# EAGLE design PIC32 (EAGLE 8.1.0)
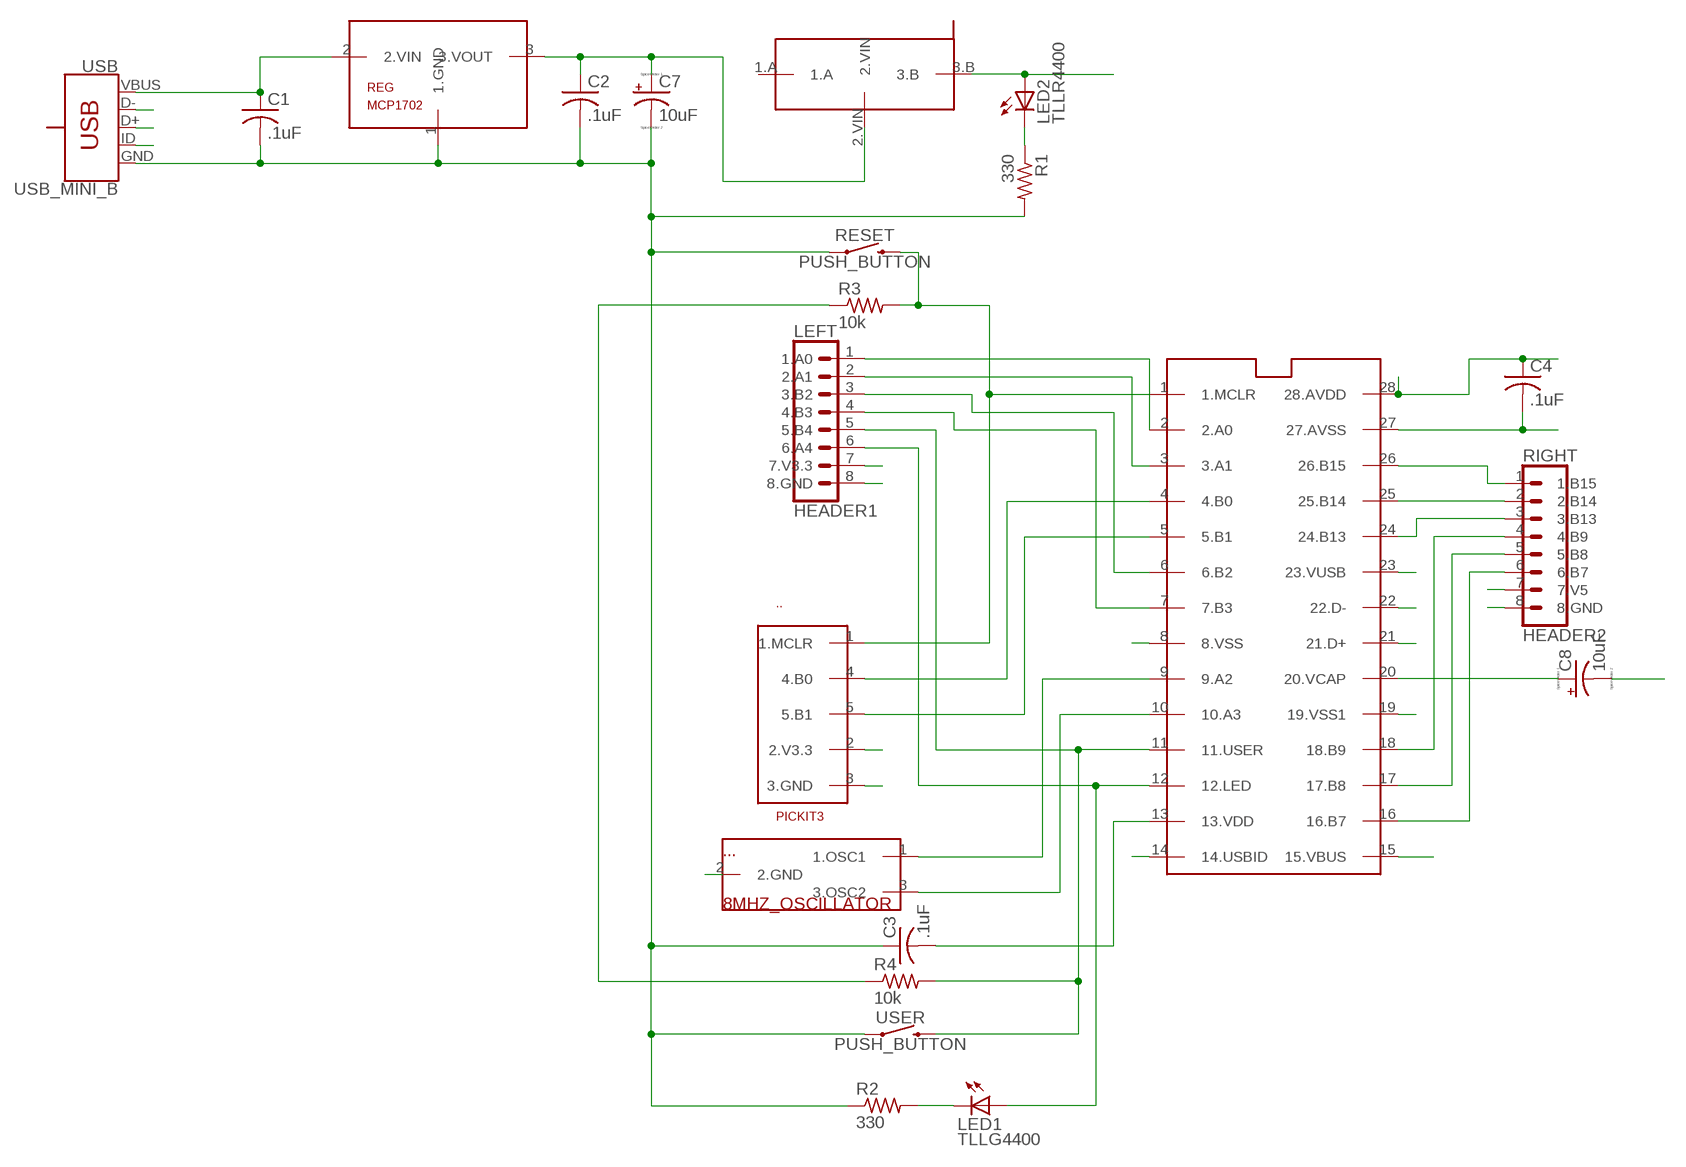
[diagram p0: schematic, sheet 1]

## Parts
..  PICKIT3  [1X05]
...  8MHZ_OSCILLATOR  [1X03]
C1  .1uF  C-US025-025X050  [C025-025X050]
C2  .1uF  C-US025-025X050  [C025-025X050]
C3  .1uF  C-US025-025X050  [C025-025X050]
C4  .1uF  C-US025-025X050  [C025-025X050]
C7  10uF  CPOL-USE5-8.5  [E5-8,5]
C8  10uF  CPOL-USE5-8.5  [E5-8,5]
DIP_28  PIC32MX250F128_DIP  [DIL28-3]
LED1  TLLG4400  [LED3MM]
LED2  TLLR4400  [LED3MM]
LEFT  HEADER1  [1X08]
R1  330  R-US_0207/10  [0207/10]
R2  330  R-US_0207/10  [0207/10]
R3  10k  R-US_0207/10  [0207/10]
R4  10k  R-US_0207/10  [0207/10]
REG  MCP1702  [TO92]
RESET  PUSH_BUTTON  [PB]
RIGHT  HEADER2  [1X08]
U$5  SLIDE_SWITCH  [SLIDE_SWITCH]
USB  USB_MINI_B  [USB-MB-H]
USER  PUSH_BUTTON  [PB]

## Nets
A0: DIP_28.2(2.A0) LEFT.1(1.A0)
A1: DIP_28.3(3.A1) LEFT.2(2.A1)
A2: ....1(1.OSC1) DIP_28.9(9.A2)
A3: ....3(3.OSC2) DIP_28.10(10.A3)
A4: DIP_28.12(12.LED) LED1.A LEFT.6(6.A4)
B0: ...4(4.B0) DIP_28.4(4.B0)
B1: ...5(5.B1) DIP_28.5(5.B1)
B2: DIP_28.6(6.B2) LEFT.3(3.B2)
B3: DIP_28.7(7.B3) LEFT.4(4.B3)
B4: DIP_28.11(11.USER) LEFT.5(5.B4) R4.2 USER.2
B7: DIP_28.16(16.B7) RIGHT.6(6.B7)
B8: DIP_28.17(17.B8) RIGHT.5(5.B8)
B9: DIP_28.18(18.B9) RIGHT.4(4.B9)
B13: DIP_28.24(24.B13) RIGHT.3(3.B13)
B14: DIP_28.25(25.B14) RIGHT.2(2.B14)
B15: DIP_28.26(26.B15) RIGHT.1(1.B15)
D+: DIP_28.21(21.D+) USB.D+(3.D+)
D-: DIP_28.22(22.D-) USB.D-(2.D-)
GND: ...3(3.GND) ....2(2.GND) C1.2 C2.2 C3.1 C4.2 C7.- C8.- DIP_28.8(8.VSS) DIP_28.27(27.AVSS) LEFT.8(8.GND) R1.2 R2.1 REG.1(1.GND) RESET.1 RIGHT.8(8.GND) USB.GND(5.GND) USER.1
ID: DIP_28.14(14.USBID) USB.ID(4.ID)
MCLR: ...1(1.MCLR) DIP_28.1(1.MCLR) R3.2 RESET.2
N$4: C2.1 C7.+ REG.3(3.VOUT) U$5.2.VIN
N$5: LED2.K(C) R1.1
N$14: LED1.K(C) R2.2
V3.3: ...2(2.V3.3) C3.2 C4.1 DIP_28.13(13.VDD) DIP_28.19(19.VSS1) DIP_28.23(23.VUSB) DIP_28.28(28.AVDD) LED2.A LEFT.7(7.V3.3) R3.1 R4.1 U$5.3.B
VBUS: C1.1 DIP_28.15(15.VBUS) REG.2(2.VIN) RIGHT.7(7.V5) USB.VBUS(1.VBUS)
VCAP: C8.+ DIP_28.20(20.VCAP)
Unconnected: U$5.1.A

## Library data of the parts
.. = meche-433:PICKIT3
... = meche-433:8MHZ_OSCILLATOR
C1-C4 = resistor:C-US: CAPACITOR, American symbol
C7 C8 = resistor:CPOL-US: POLARIZED CAPACITOR, American symbol
DIP_28 = meche-433:PIC32MX250F128_DIP
LED1 = led:TLLG4400: Low Current (2mA) LED 3 mm Tinted Diffused Package color GREEN Source: Data sheet <http://www.farnell.com/datasheets/391098.pdf>; MF: VISHAY SEMICONDUCTOR; OC_FARNELL: 1612435
LED2 = led:TLLR4400: Low Current (2mA) LED 3 mm Tinted Diffused Package color RED Source: Data sheet <http://www.farnell.com/datasheets/391100.pdf>; MF: VISHAY SEMICONDUCTOR; OC_FARNELL: 1612437
LEFT = meche-433:HEADER1
R1-R4 = resistor:R-US_: RESISTOR, American symbol
REG = meche-433:MCP1702
RESET USER = meche-433:PUSH_BUTTON
RIGHT = meche-433:HEADER2
U$5 = meche-433:SLIDE_SWITCH
USB = meche-433:USB_MINI_B

## Board
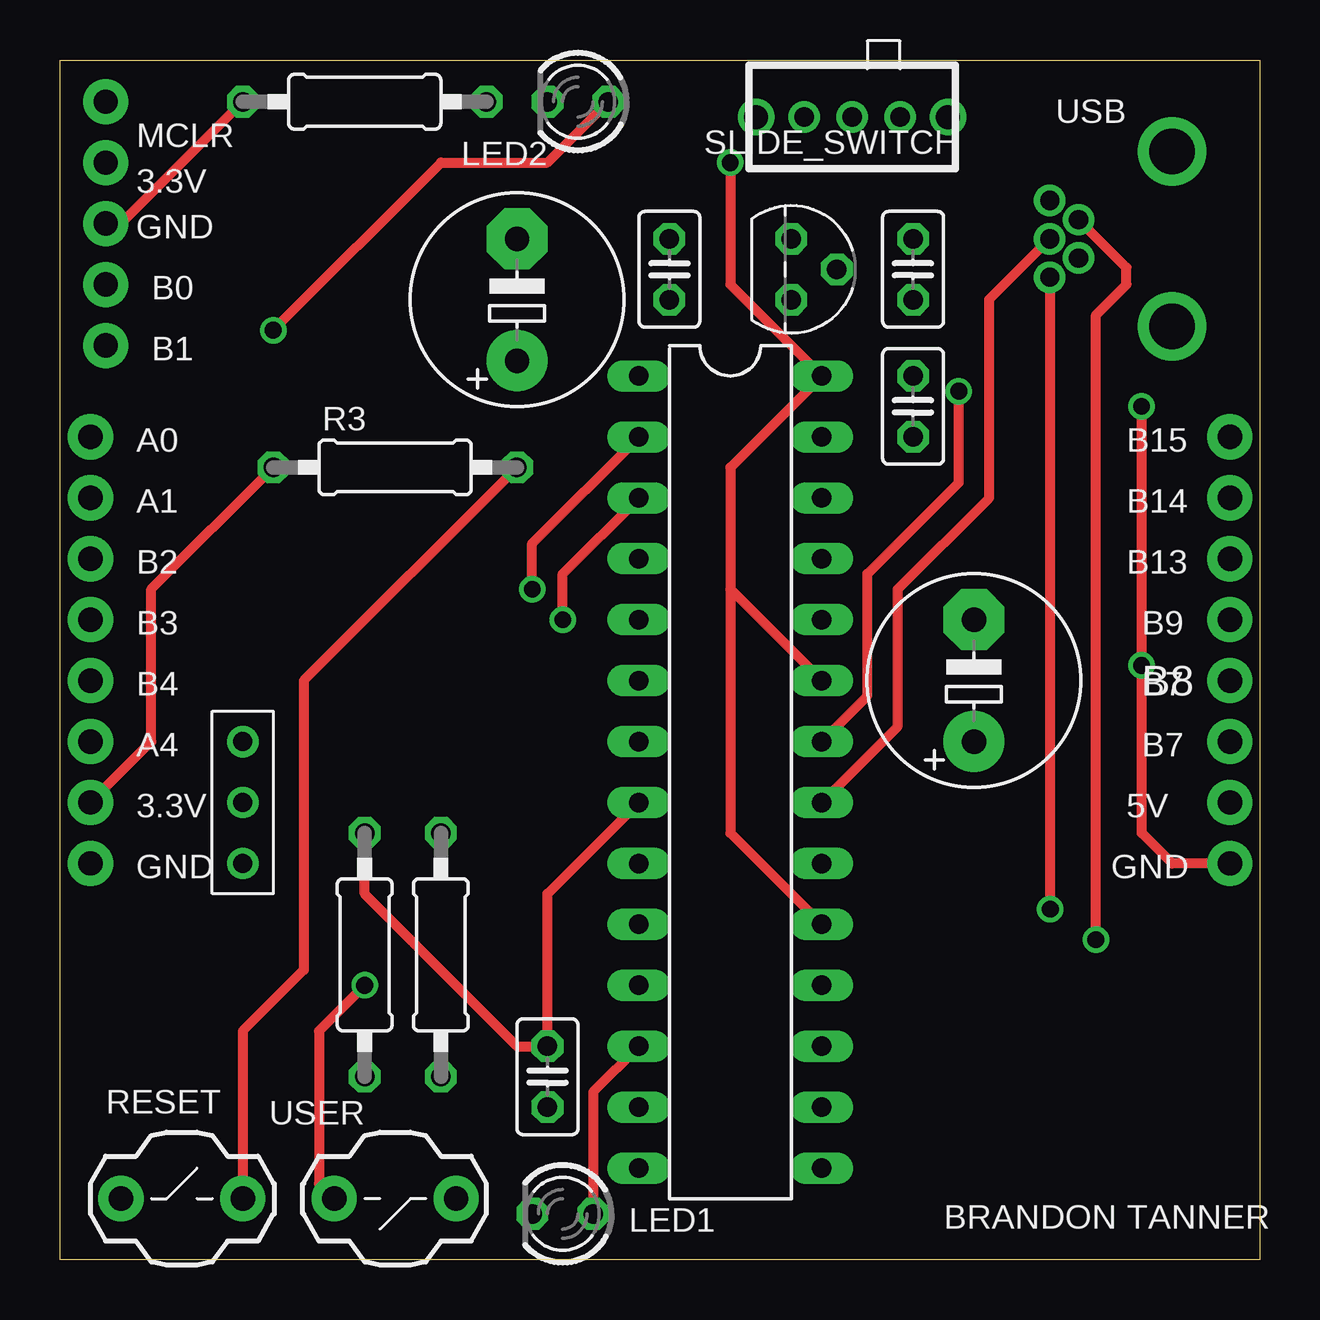
[diagram p1: board, top side]
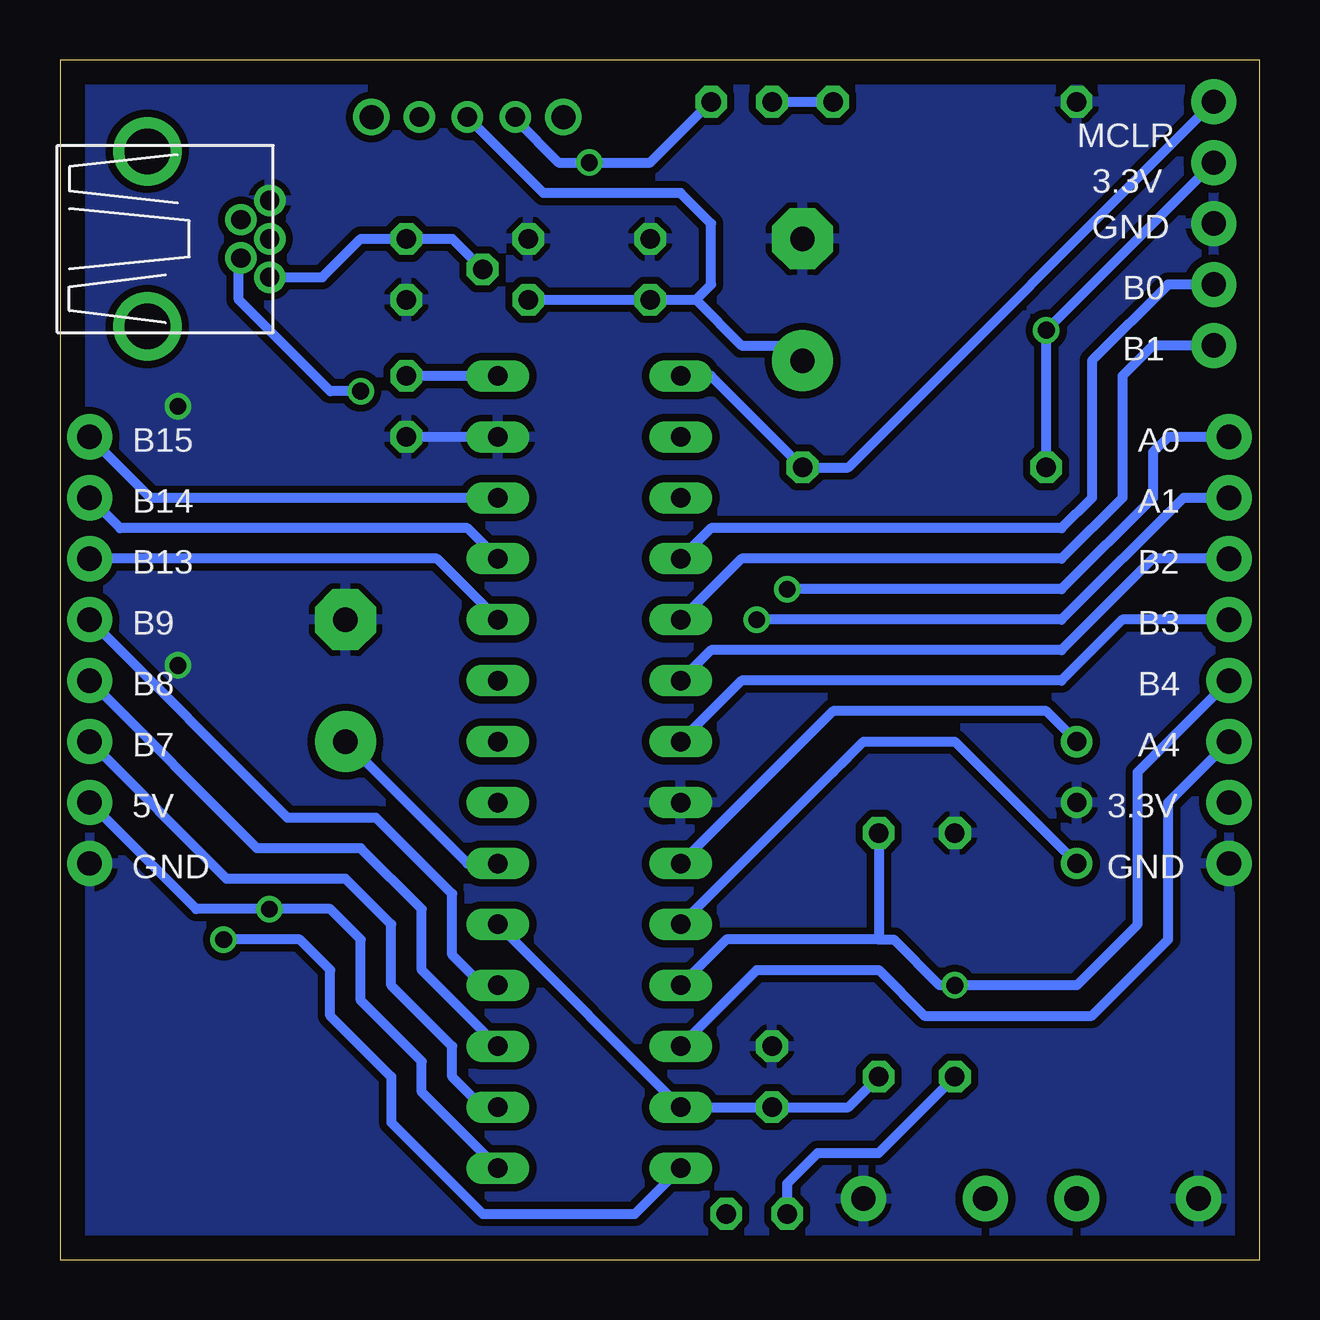
[diagram p2: board, bottom side, seen from below]

Size 50 x 50 mm. Coordinates in mm from the lower left corner, seen from the top.
Outline: 50,0 0,0 0,50 50,50 50,0
Copper layers (1*16): Top 0.035mm / dielectric 1.5mm / Bottom 0.035mm
Design rules "default": minimum track width 10mil, minimum drill 24mil, track to track 8mil, track to pad 8mil, pad to pad 8mil, via to via 8mil, smd to smd 8mil, copper to edge 40mil, drill to drill 8mil, minimum pad ring 10mil, minimum via ring 8mil, stop-mask expansion 4mil, vias tented up to drill 0mil, thermal gap 10mil

### Footprints (pad centres in the part's own frame; a part is rotated, then mirrored left to right if it is on the bottom)
1X05 = drill 1.016 pad 1.88: 1 0,0; 2 2.54,0; 3 5.08,0; 4 7.62,0; 5 10.16,0
1X03 = drill 0.8: 1 0,2.54; 2 0,0; 3 0,-2.54
C025-025X050 = drill 0.813 octagon: 1 -1.27,0; 2 1.27,0
E5-8,5 = drill 1.016 pad 2.54: + -2.54,0 | drill 1.016 pad 2.54 octagon: - 2.54,0
DIL28-3 = drill 0.813 long: 1 -16.51,-3.81; 2 -13.97,-3.81; 3 -11.43,-3.81; 4 -8.89,-3.81; 5 -6.35,-3.81; 6 -3.81,-3.81; 7 -1.27,-3.81; 8 1.27,-3.81; 9 3.81,-3.81; 10 6.35,-3.81; 11 8.89,-3.81; 12 11.43,-3.81; 13 13.97,-3.81; 14 16.51,-3.81; 15 16.51,3.81; 16 13.97,3.81; 17 11.43,3.81; 18 8.89,3.81; 19 6.35,3.81; 20 3.81,3.81; 21 1.27,3.81; 22 -1.27,3.81; 23 -3.81,3.81; 24 -6.35,3.81; 25 -8.89,3.81; 26 -11.43,3.81; 27 -13.97,3.81; 28 -16.51,3.81
LED3MM = drill 0.813 octagon: A -1.27,0; K 1.27,0
1X08 = drill 1.016 pad 1.88: 1 0,0; 2 2.54,0; 3 5.08,0; 4 7.62,0; 5 10.16,0; 6 12.7,0; 7 15.24,0; 8 17.78,0
0207/10 = drill 0.813 octagon: 1 -5.08,0; 2 5.08,0
TO92 = drill 0.813 octagon: 1 -1.27,0; 2 0,1.905; 3 1.27,0
PB = drill 1.016 pad 1.88: 1 0,0; 2 5.08,0
SLIDE_SWITCH = drill 0.8: 1.A 0,2; 2.VIN 0,0; 3.B 0,-2 | drill 1: ANCHOR1 0,4; ANCHOR2 0,-4
USB-MB-H = drill 0.8: D+ 5.1,0; D- 3.9,0.8; GND 5.1,-1.6; ID 3.9,-0.8; VBUS 5.1,1.6 | drill 1.9: P$6 0,-3.65; P$7 0,3.65

### Placement (x,y rotation side)
..  1.91,48.26 270 top
...  7.62,19.05 0 top
C1  35.56,41.27 270 top
C2  25.4,41.27 90 top
C3  20.32,7.62 270 top
C4  35.56,35.56 270 top
C7  19.05,40.01 90 top
C8  38.1,24.13 90 top
DIP_28  27.94,20.32 270 top
LED1  20.95,1.91 180 top
LED2  21.59,48.26 180 top
LEFT  1.27,34.29 270 top
R1  12.7,48.26 180 top
R2  12.7,12.7 270 top
R3  13.97,33.02 0 top
R4  15.88,12.7 90 top
REG  30.48,41.27 270 top
RESET  2.54,2.54 0 top
RIGHT  48.77,34.29 270 top
U$5  33.02,47.62 270 top
USB  46.35,42.55 180 top
USER  16.51,2.54 180 top

### Tracks (layer width: path | path; a pad name or v marks a point on that pad's centre or on a via)
A0  (via drill 0.7)
  Top 0.406: v19.68,27.94 19.68,29.84 DIP_28.2
  Bottom 0.406: LEFT.1 3.81,34.29 4.45,33.66 4.45,31.75 8.26,27.94 v19.68,27.94
A1  (via drill 0.7)
  Top 0.406: v20.95,26.67 20.95,28.57 DIP_28.3
  Bottom 0.406: LEFT.2 3.17,31.75 8.26,26.67 v20.95,26.67
A2
  Bottom 0.406: ....1 8.89,22.86 17.78,22.86 DIP_28.9
A3
  Bottom 0.406: DIP_28.10 17.78,20.32 | 17.78,20.32 17.14,20.95 | 17.78,20.32 16.51,21.59 12.7,21.59 ....3
A4
  Top 0.406: DIP_28.12 22.23,6.99 LED1.A
  Bottom 0.406: DIP_28.12 20.95,12.06 15.88,12.06 13.97,10.16 6.99,10.16 3.81,13.34 3.81,19.05 LEFT.6
B0
  Bottom 0.406: ...4 3.81,40.64 6.99,37.47 6.99,31.75 8.26,30.48 22.86,30.48 DIP_28.4
B1
  Bottom 0.406: ...5 4.45,38.1 5.71,36.83 5.71,31.75 8.26,29.21 21.59,29.21 DIP_28.5
B2
  Bottom 0.406: LEFT.3 4.45,29.21 8.26,25.4 22.86,25.4 DIP_28.6
B3
  Bottom 0.406: LEFT.4 5.71,26.67 8.26,24.13 21.59,24.13 DIP_28.7
B4  (via drill 0.7)
  Top 0.406: v12.7,11.43 10.79,9.53 10.79,3.17 USER.2
  Bottom 0.406: DIP_28.11 22.23,13.34 15.88,13.34 | 15.88,13.34 15.24,13.34 13.34,11.43 v12.7,11.43 7.62,11.43 5.08,13.97 5.08,20.32 LEFT.5 | R4.2 15.88,13.34
B7
  Bottom 0.406: DIP_28.16 32.38,6.35 33.66,7.62 33.66,8.89 36.2,11.43 36.2,13.97 38.1,15.88 43.05,15.88 RIGHT.6
B8
  Bottom 0.406: DIP_28.17 34.92,12.06 34.92,14.61 37.47,17.14 41.78,17.14 RIGHT.5
B9
  Bottom 0.406: DIP_28.18 32.38,11.43 33.66,12.7 33.66,15.24 36.83,18.41 40.51,18.41 RIGHT.4
B13
  Bottom 0.406: DIP_28.24 34.29,29.21 RIGHT.3
B14
  Bottom 0.406: DIP_28.25 33.02,30.48 47.5,30.48 RIGHT.2
B15
  Bottom 0.406: DIP_28.26 46.23,31.75 RIGHT.1
D+
  Top 0.406: DIP_28.21 34.92,22.23 34.92,27.94 38.73,31.75 38.73,40.02 USB.D+
D-  (via drill 0.7)
  Top 0.406: DIP_28.22 33.66,23.5 33.66,28.57 37.47,32.38 v37.47,36.2
  Bottom 0.406: v37.47,36.2 38.73,36.2 42.55,40.01 42.55,41.66 USB.D-
GND  (via drill 0.7)
  Top 0.406: R2.1 12.7,15.24 19.05,8.89 C3.1 20.32,15.24 DIP_28.8 | RIGHT.8 46.35,16.51 45.09,17.78 v45.09,24.77 v45.09,35.56 | ...3 2.54,43.18 R1.2
  Bottom 0.406: DIP_28.27 C4.2
  pour Bottom (isolate 0.305): 0,49.53 49.53,49.53 49.53,0 0,0
ID  (via drill 0.7)
  Top 0.406: v43.18,13.34 43.18,39.37 44.45,40.64 44.45,41.35 USB.ID
  Bottom 0.406: v43.18,13.34 40.01,13.34 38.73,12.06 38.73,10.16 36.2,7.62 36.2,5.71 32.38,1.91 26.04,1.91 DIP_28.14
MCLR
  Top 0.406: R3.2 10.16,24.13 10.16,12.06 7.62,9.53 RESET.2
  Bottom 0.406: DIP_28.1 22.86,36.83 R3.2 17.14,33.02 ...1
N$4
  Bottom 0.406: REG.3 C2.1 23.5,40.01 | C7.+ 19.68,38.1 21.59,38.1 23.5,40.01 | 23.5,40.01 22.86,40.64 22.86,43.18 24.13,44.45 29.84,44.45 U$5.2.VIN
N$5
  Bottom 0.406: LED2.K R1.1
N$14
  Bottom 0.406: LED1.K 19.68,3.17 18.41,4.45 15.88,4.45 R2.2
V3.3  (via drill 0.7)
  Top 0.406: LEFT.7 3.81,21.59 3.81,27.94 R3.1 | v27.94,45.72 27.94,40.64 DIP_28.28 27.94,33.02 27.94,27.94 | v8.89,38.73 15.88,45.72 20.32,45.72 LED2.A | 27.94,27.94 DIP_28.23 | 27.94,27.94 27.94,17.78 DIP_28.19
  Bottom 0.406: DIP_28.28 C4.1 | DIP_28.19 DIP_28.13 C3.2 17.14,6.35 R4.1 | U$5.3.B 31.02,47.53 29.21,45.72 v27.94,45.72 25.4,45.72 LED2.A | R3.1 v8.89,38.73 ...2
VBUS  (via drill 0.7)
  Top 0.406: v41.27,14.61 41.27,40.92 USB.VBUS
  Bottom 0.406: REG.2 33.66,42.55 C1.1 37.47,42.55 39.06,40.95 USB.VBUS | DIP_28.15 34.92,6.99 34.92,8.26 37.47,10.79 37.47,13.34 38.73,14.61 v41.27,14.61 44.32,14.61 RIGHT.7
VCAP
  Bottom 0.406: DIP_28.20 33.02,16.51 C8.+

### Text on the board
tPlace: MCLR | 3.3V | GND | B0 | B1 | A0 | B15 | A1 | B14 | B2 | B13 | B3 | B9 | B4 | B7 | B8 | A4 | B7 | 3.3V | 5V | GND | GND | BRANDON TANNER
bPlace: MCLR | 3.3V | GND | B0 | B1 | A0 | B15 | A1 | B14 | B2 | B13 | B3 | B9 | B4 | B8 | A4 | B7 | 3.3V | 5V | GND | GND